# EasyEDA Pro project ADA4530_2025-03-15.epro, schematic Schematic2

## Sheets
1 P1: Company: 嘉立创EDA; Page Size: A4; Version: V1.0
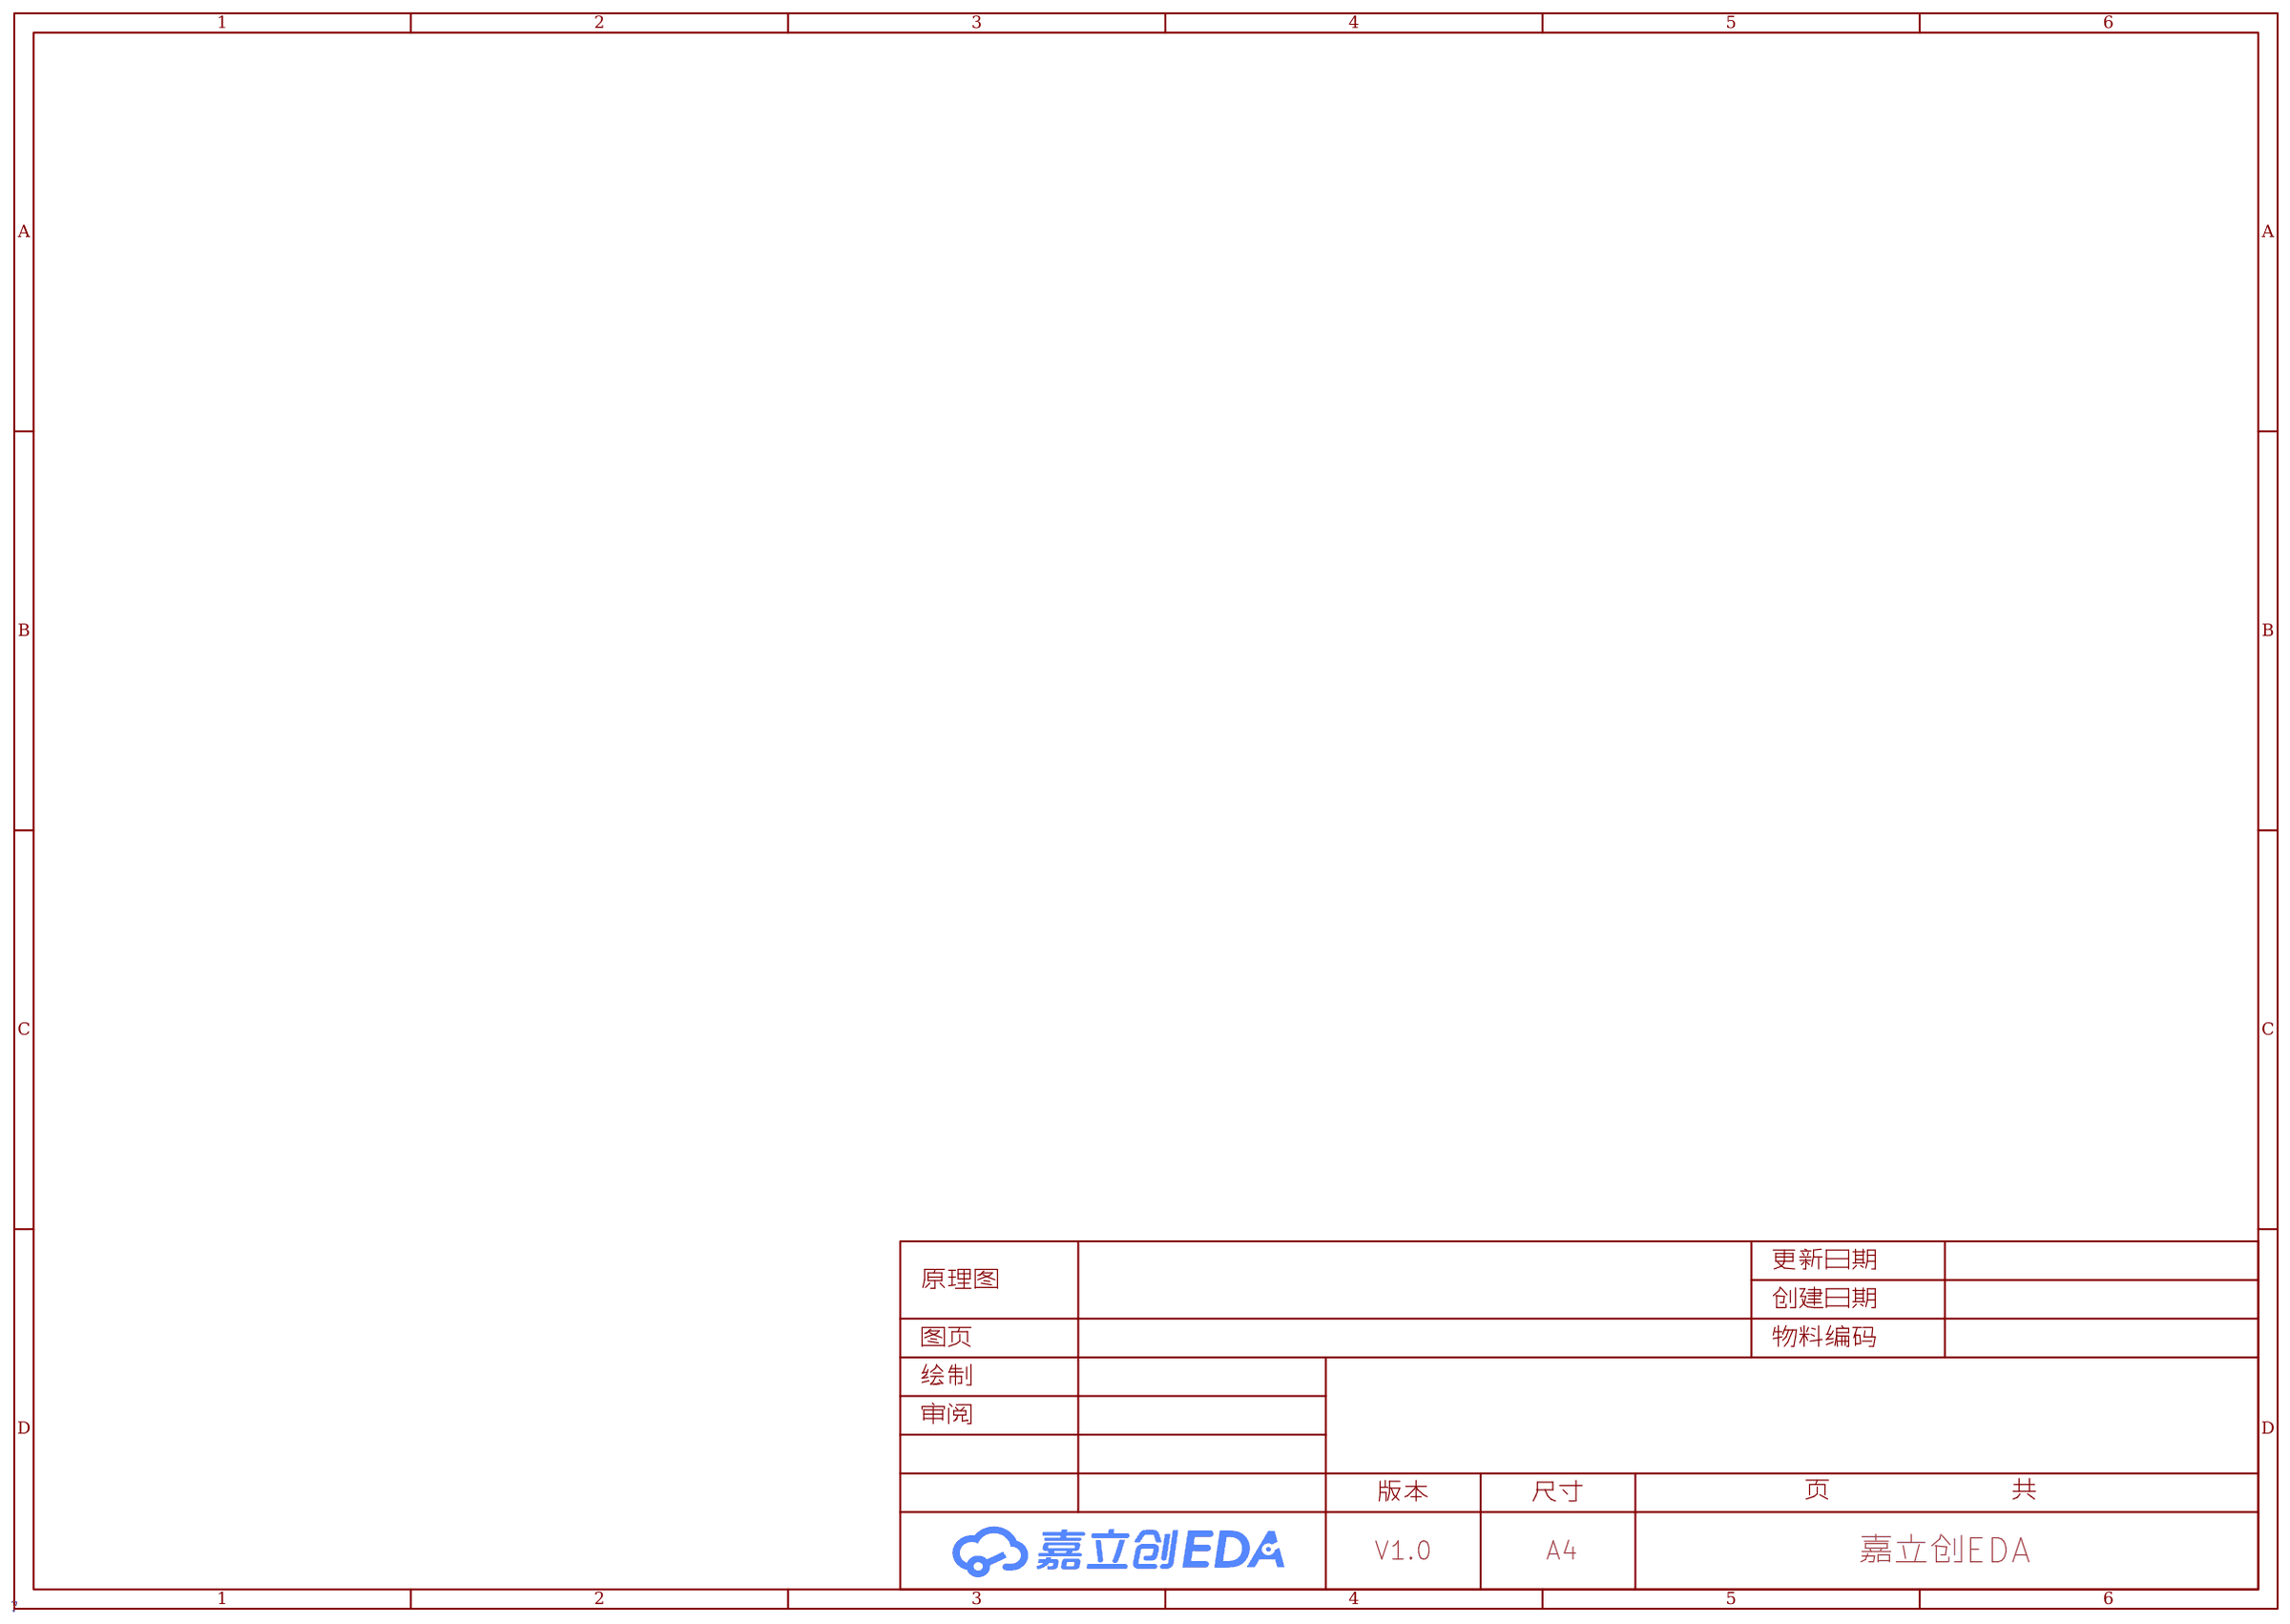
[diagram p0: P1]
2 LDO power supply
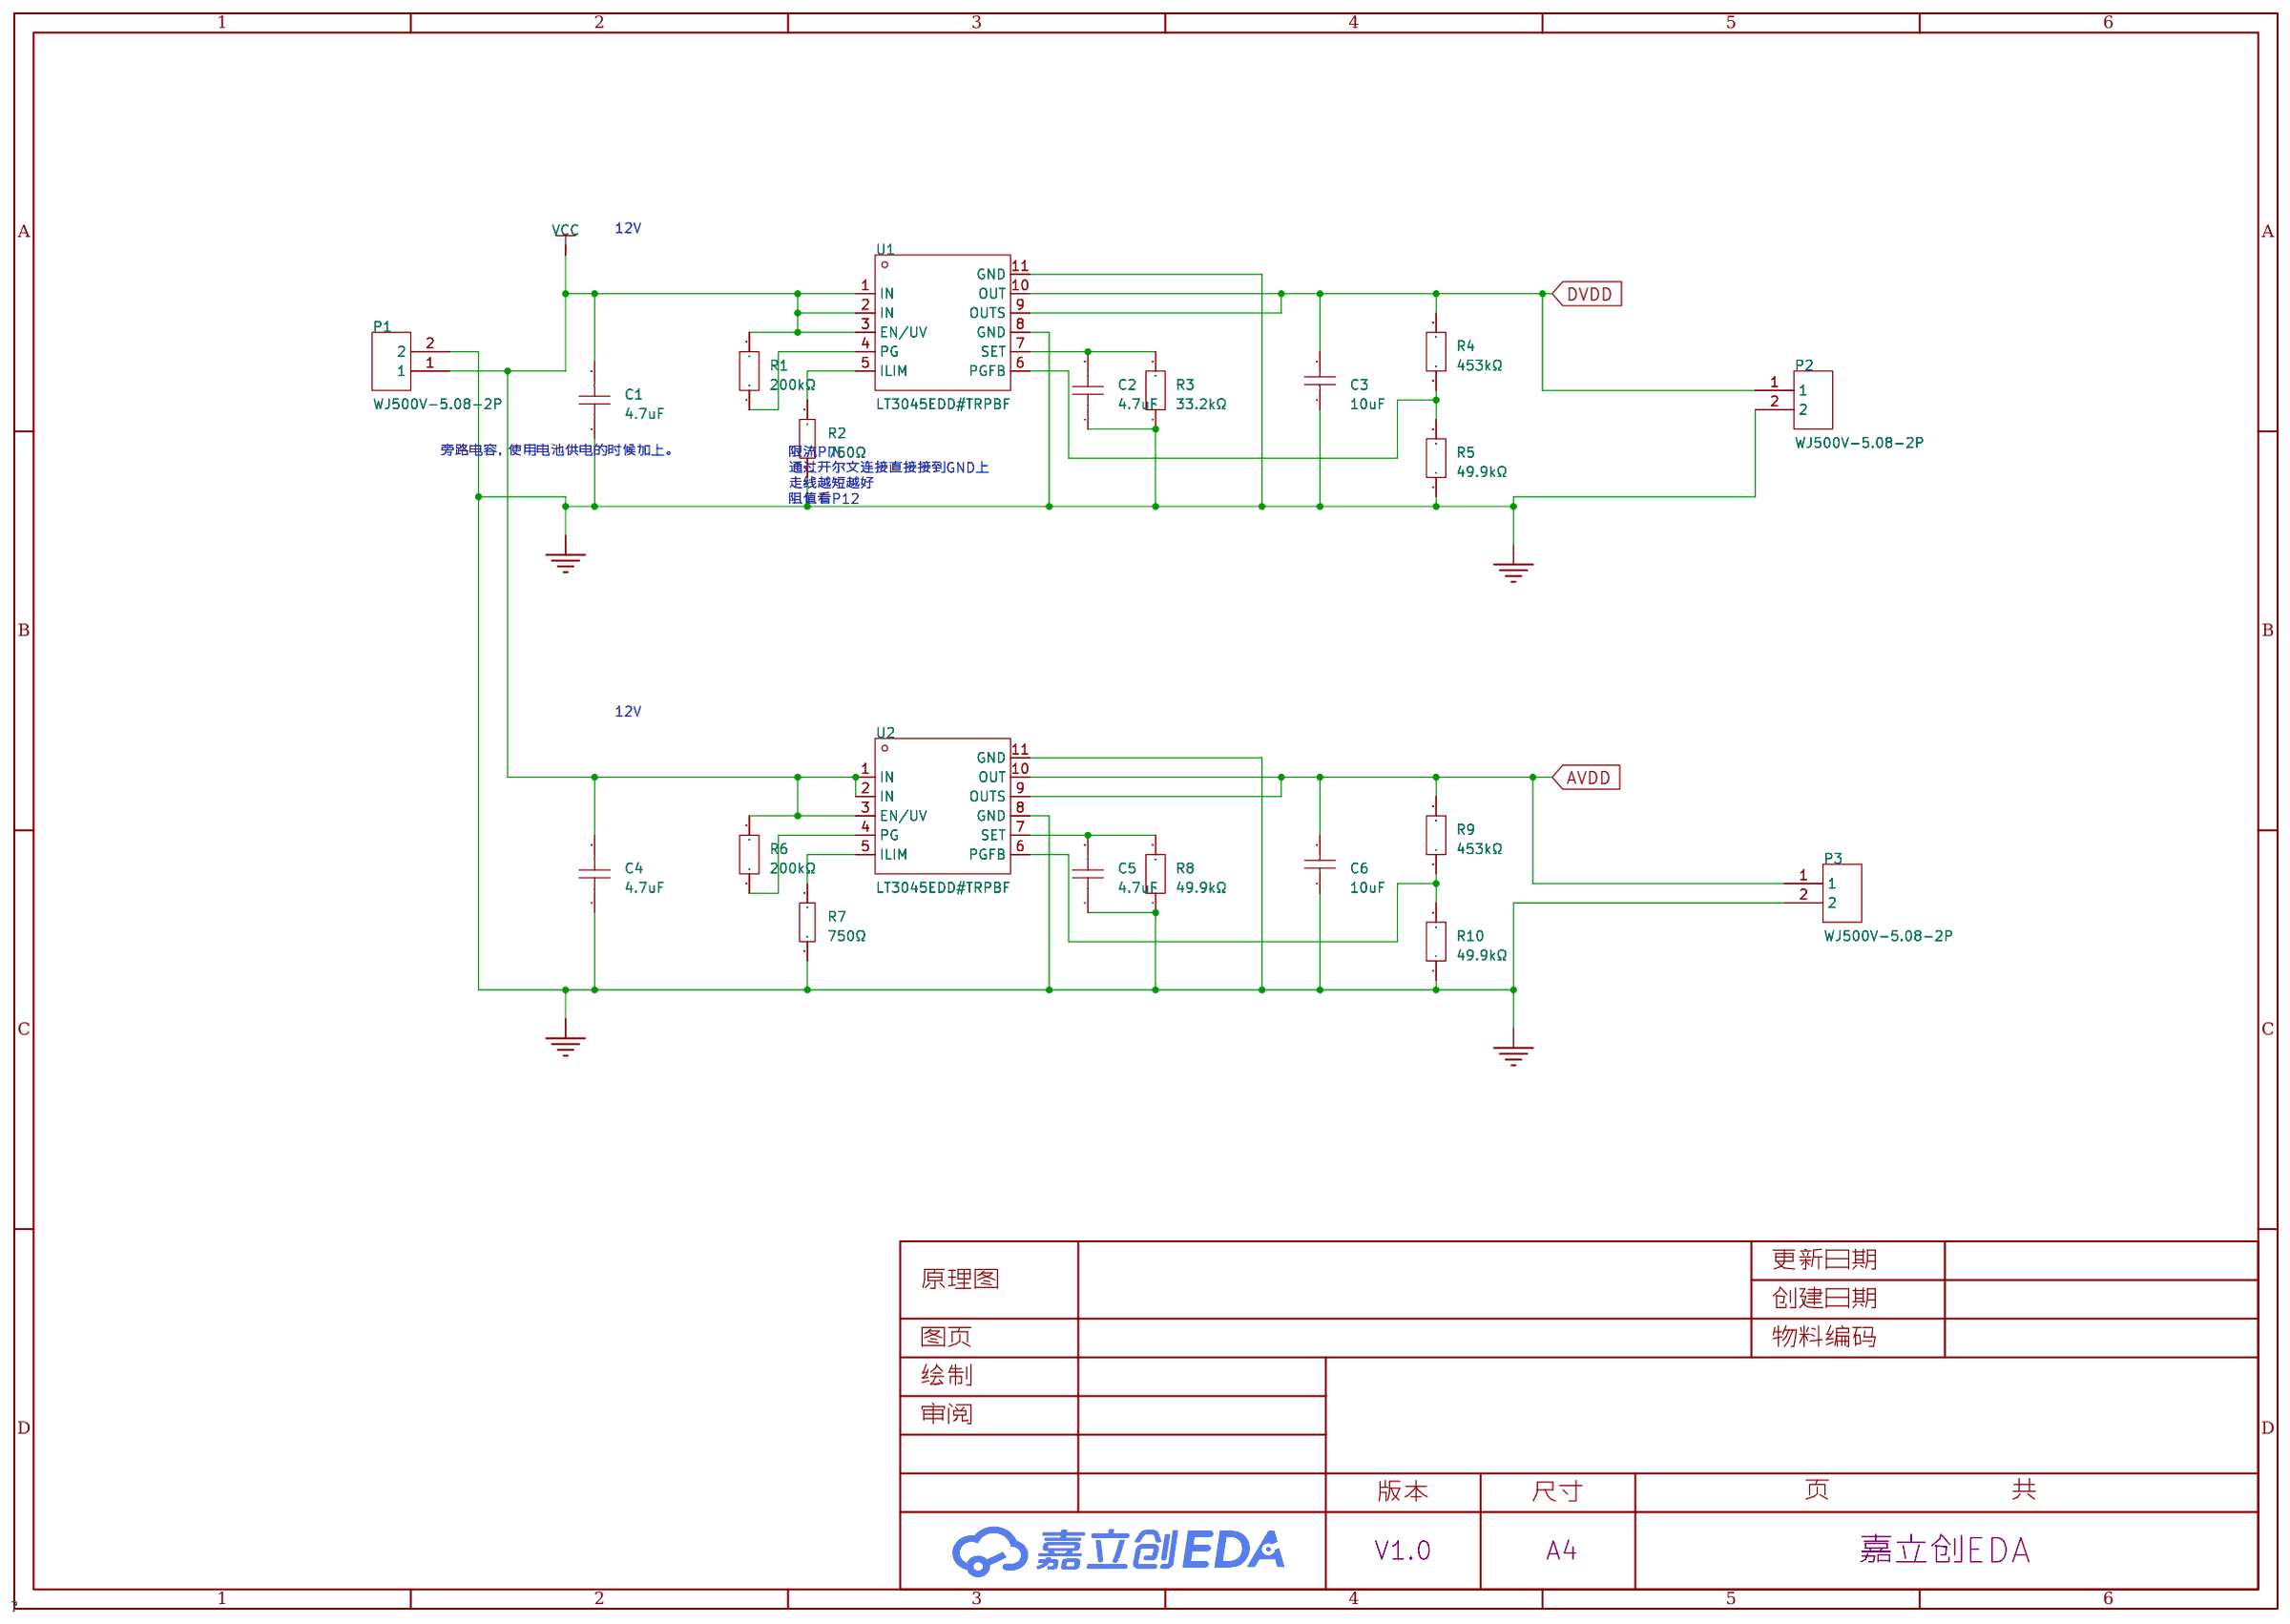
[diagram p1: LDO power supply]

## Parts
C1  4.7uF  [C1206]
C2  4.7uF  [C1206]
C3  10uF  [4line-capacitance]
C4  4.7uF  [C1206]
C5  4.7uF  [C1206]
C6  10uF  [4line-capacitance]
P1  WJ500V-5.08-2P  [CONN-TH_2P-P5.00_WJ500V-5.08-2P]
P2  WJ500V-5.08-2P  [CONN-TH_2P-P5.00_WJ500V-5.08-2P]
P3  WJ500V-5.08-2P  [CONN-TH_2P-P5.00_WJ500V-5.08-2P]
R1  200kΩ  [R0603]
R2  750Ω  [R1206]
R3  33.2kΩ  [R0603]
R4  453kΩ  [R0603]
R5  49.9kΩ  [R0603]
R6  200kΩ  [R0603]
R7  750Ω  [R1206]
R8  49.9kΩ  [R0603]
R9  453kΩ  [R0603]
R10  49.9kΩ  [R0603]
U1  LT3045EDD#TRPBF  [DFN-10_L3.0-W3.0-P0.50-BL-EP]
U2  LT3045EDD#TRPBF  [DFN-10_L3.0-W3.0-P0.50-BL-EP]

## Library data of the parts
C1 C2 C4 C5 = CC1206KKX5R9BB475: 容值:4.7uF;精度:±10%;额定电压:50V;材质(温度系数):X5R;; LCSC Part Name: 4.7uF ±10% 50V; Supplier Part: C723528; Manufacturer: YAGEO(国巨); Supplier Footprint: 1206; JLCPCB Part Class: 扩展库; Datasheet: https://atta.szlcsc.com/upload/public/pdf/source/20200814/C723528_C4F3FBBB7D98A8F8FDDCCB6735FB2432.pdf; Supplier: LCSC; Tolerance: ±10%; Voltage Rated: 50V; Temperature Coefficient: X5R
C3 C6 = CL31A106KAHNNNE: 容值:10uF;精度:±10%;额定电压:25V;材质(温度系数):X5R;; LCSC Part Name: 10uF ±10% 25V; Supplier Part: C9807; Manufacturer: SAMSUNG(三星); JLCPCB Part Class: 扩展库; Datasheet: https://atta.szlcsc.com/upload/public/pdf/source/20160218/1457707763339.pdf; Supplier: LCSC; Tolerance: ±10%; Voltage Rated: 25V; Temperature Coefficient: X5R
P1-P3 = WJ500V-5.08-2P: 结构:1x2P;间距:5.08mm;颜色:绿色;安装方式:直插;额定电流:18A;额定电压:250V;排数:1;线规 - AWG:14~30;线规 - 平方毫米:2.5;每排PIN数:2;触头材质:-;触头镀层:-;工作温度范围:-40℃~+105℃;焊接温度(最大值):-;; LCSC Part Name: 1x2P 5.08mm 直插 排数:1 每排P数:2; Supplier Part: C8465; Manufacturer: KANGNEX(康奈克斯电气); Supplier Footprint: 插件,P=5.08mm; JLCPCB Part Class: 扩展库; Datasheet: https://atta.szlcsc.com/upload/public/pdf/source/20191225/C8465_02D34CE5B5B4A53DF5891601D97FA9F4.pdf; Supplier: LCSC; Structure: 1x2P; Pitch: 5.08mm; Color: 绿色; Mounting Style: 直插; Current Rating (Max): 18A; Voltage Rating (Max): 250V; Number of Pins: 2P; Number of Rows: 1; Wire Gauge - AWG: 14~30; Wire Gauge - mm2: 2.5; Number of PINs Per Row: 2; Operating Temperature Range: -40℃~+105℃; Screw Specification: M2.5
R1 R6 = CRCW0603200KJNEA: 电阻类型:厚膜电阻;阻值:200kΩ;精度:±5%;功率:100mW;温度系数:±200ppm/℃;; LCSC Part Name: 厚膜电阻 200kΩ ±5% 100mW; Supplier Part: C843928; Manufacturer: VISHAY(威世); Supplier Footprint: 0603; JLCPCB Part Class: 扩展库; Datasheet: https://atta.szlcsc.com/upload/public/pdf/source/20221018/57062C89AB464F61DB643BD1D086C581.pdf; Supplier: LCSC; Type: 厚膜电阻; Tolerance: ±5%; Power(Watts): 100mW; Temperature Coefficient: ±200ppm/℃; Operating Temperature Range: -55℃~+155℃
R2 R7 = 1206W4F7500T5E: 电阻类型:厚膜电阻;阻值:750Ω;精度:±1%;功率:250mW;最大工作电压:200V;温度系数:±100ppm/℃;; LCSC Part Name: 750Ω ±1% 250mW 厚膜电阻; Supplier Part: C17985; Manufacturer: UNI-ROYAL(厚声); Supplier Footprint: 1206; JLCPCB Part Class: 扩展库; Datasheet: https://atta.szlcsc.com/upload/public/pdf/source/20200306/C422600_1E6D84923E4A46A82E41ADD87F860B5C.pdf; Supplier: LCSC; Type: 厚膜电阻; Tolerance: ±1%; Power(Watts): 250mW; Overload Voltage (Max): 200V; Temperature Coefficient: ±100ppm/℃; Operating Temperature Range: -55℃~+155℃
R3 = TNPW060333K2BEEA: 电阻类型:薄膜电阻;阻值:33.2kΩ;精度:±0.1%;功率:125mW;最大工作电压:75V;温度系数:±25ppm/℃;; LCSC Part Name: 薄膜电阻 33.2kΩ ±0.1% 125mW; Supplier Part: C2075328; Manufacturer: VISHAY(威世); Supplier Footprint: 0603; JLCPCB Part Class: 扩展库; Datasheet: https://atta.szlcsc.com/upload/public/pdf/source/20210611/7E5076F8AE36443BBEA8C2F8BE3882EA.pdf; Supplier: LCSC; Type: 薄膜电阻; Tolerance: ±0.1%; Power(Watts): 125mW; Overload Voltage (Max): 75V; Temperature Coefficient: ±25ppm/℃; Operating Temperature Range: -55℃~+155℃
R4 R9 = FRC0603F4533TS: 电阻类型:厚膜电阻;阻值:453kΩ;精度:±1%;功率:100mW;最大工作电压:75V;温度系数:±100ppm/℃;; LCSC Part Name: 453kΩ ±1% 100mW 厚膜电阻; Supplier Part: C3013202; Manufacturer: FOJAN(富捷); Supplier Footprint: 0603; JLCPCB Part Class: 扩展库; Datasheet: https://atta.szlcsc.com/upload/public/pdf/source/20211221/925EC7D7225764EE0046F22065062C87.pdf; Supplier: LCSC; Type: 厚膜电阻; Tolerance: ±1%; Power(Watts): 100mW; Overload Voltage (Max): 75V; Temperature Coefficient: ±100ppm/℃
R5 R10 = FRC0603F4992TS: 电阻类型:厚膜电阻;阻值:49.9kΩ;精度:±1%;功率:100mW;最大工作电压:75V;温度系数:±100ppm/℃;; LCSC Part Name: 49.9kΩ ±1% 100mW 厚膜电阻; Supplier Part: C2930109; Manufacturer: FOJAN(富捷); Supplier Footprint: 0603; JLCPCB Part Class: 扩展库; Datasheet: https://atta.szlcsc.com/upload/public/pdf/source/20211221/925EC7D7225764EE0046F22065062C87.pdf; Supplier: LCSC; Type: 厚膜电阻; Tolerance: ±1%; Power(Watts): 100mW; Overload Voltage (Max): 75V; Temperature Coefficient: ±100ppm/℃; Operating Temperature Range: -55℃~+155℃
R8 = TNPW060333K2BEEA: 电阻类型:薄膜电阻;阻值:33.2kΩ;精度:±0.1%;功率:125mW;最大工作电压:75V;温度系数:±25ppm/℃;; LCSC Part Name: 薄膜电阻 33.2kΩ ±0.1% 125mW; Supplier Part: C313766; Manufacturer: VISHAY(威世); Manufacturer Part: CRCW060349K9FKEAHP; Supplier Footprint: 0603; JLCPCB Part Class: 扩展库; Datasheet: https://atta.szlcsc.com/upload/public/pdf/source/20210611/7E5076F8AE36443BBEA8C2F8BE3882EA.pdf; Supplier: LCSC; Type: 薄膜电阻; Tolerance: ±0.1%; Power(Watts): 125mW; Overload Voltage (Max): 75V; Temperature Coefficient: ±25ppm/℃; Operating Temperature Range: -55℃~+155℃
U1 U2 = LT3045EDD#TRPBF: 输出类型:可调;最大输入电压:20V;输出电压:0V~15V;最大输出电流:500mA;输出极性:正极;; Supplier Part: C514420; Manufacturer: ADI(亚德诺); Supplier Footprint: DFN-10-EP(3x3); JLCPCB Part Class: 扩展库; Datasheet: https://atta.szlcsc.com/upload/public/pdf/source/20200416/C514420_E440C492D6C74EAE6AB301243586F696.pdf; Supplier: LCSC; Output Type: 可调; Maximum Input Voltage: 20V; Output Voltage: 0V~15V; MAX Output Current: 500mA; Dropout Voltage: 450mV@(500mA); standby current: 20uA; Operating Temperature: -40℃~+125℃@(Tj); Output Polarity: 正极; Number of Outputs: 1

## Nets
AVDD: C6.2 P3.1 R9.2 U2.9(OUTS) U2.10(OUT)
DVDD: C3.2 P2.1 R4.2 U1.9(OUTS) U1.10(OUT)
GND: C1.1 C2.1 C3.1 C4.1 C5.1 C6.1 P1.2 P2.2 P3.2 R2.1 R3.1 R5.1 R7.1 R8.1 R10.1 U1.8(GND) U1.11(GND) U2.8(GND) U2.11(GND)
VCC: C1.2 C4.2 P1.1 R1.2 R6.2 U1.1(IN) U1.2(IN) U1.3(EN/UV) U2.1(IN) U2.2(IN) U2.3(EN/UV)
$2N366: C2.2 R3.2 U1.7(SET)
$2N394: R2.2 U1.5(ILIM)
$2N511: R1.1 U1.4(PG)
$2N525: R4.1 R5.2 U1.6(PGFB)
$2N1217: R7.2 U2.5(ILIM)
$2N1218: C5.2 R8.2 U2.7(SET)
$2N1220: R6.1 U2.4(PG)
$2N1221: R9.1 R10.2 U2.6(PGFB)

## Notes on the sheets
sheet 2
- 12V
- 旁路电容，使用电池供电的时候加上。
- 限流PIN
  通过开尔文连接直接接到GND上
  走线越短越好
  阻值看P12
- 12V
